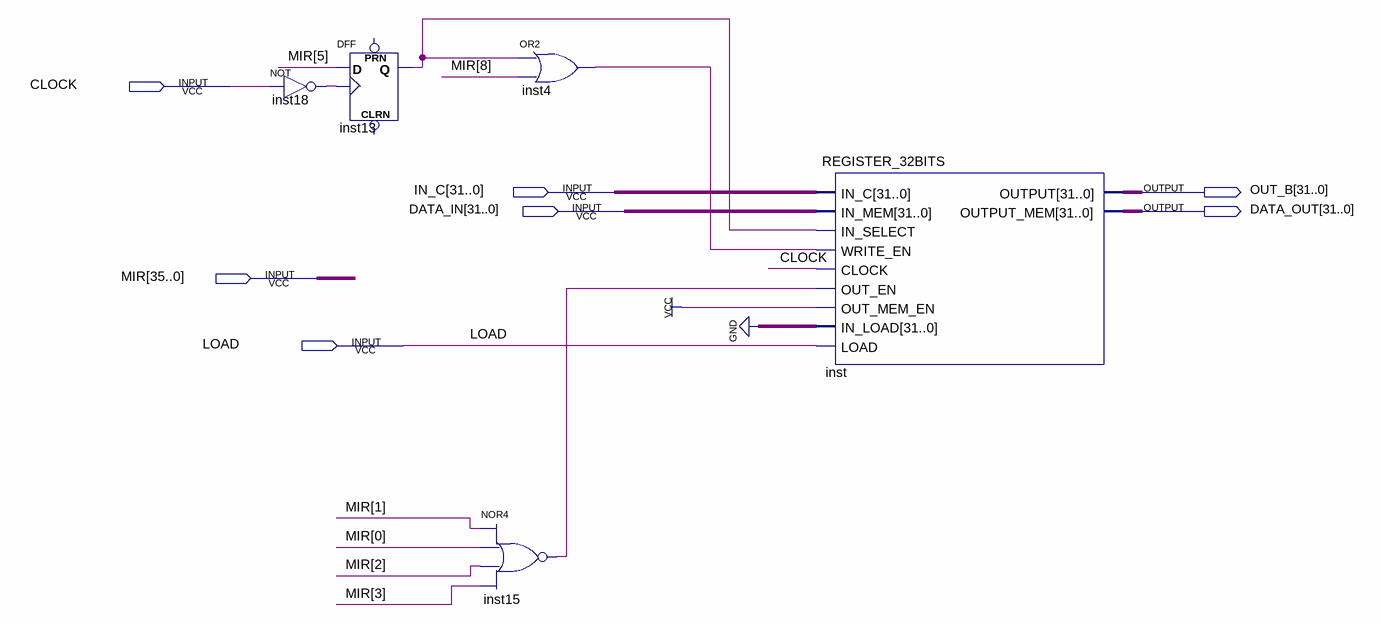
[diagram p0: schematic sheet]
// Quartus schematic MDR.bdf as structural Verilog: 5 symbols, 7 pins
module MDR (
  input  CLOCK,
  input  [31:0] IN_C,
  input  [31:0] DATA_IN,
  input  [35:0] MIR,
  input  LOAD,
  output [31:0] OUT_B,
  output [31:0] DATA_OUT
);

  wire inst4_out, inst13_q, inst15_out, inst18_out;

  not inst18 (inst18_out, CLOCK);
  DFF inst13 (.CLK(inst18_out), .D(MIR[5]), .Q(inst13_q));  // open: CLRN, PRN
  or inst4 (inst4_out, inst13_q, MIR[8]);
  nor inst15 (inst15_out, MIR[1], MIR[0], MIR[2], MIR[3]);
  REGISTER_32BITS inst (
    .IN_C(IN_C), .IN_MEM(DATA_IN), .IN_SELECT(inst13_q), .WRITE_EN(inst4_out), .CLOCK(CLOCK),
    .OUT_EN(inst15_out), .OUT_MEM_EN(1'b1), .IN_LOAD({32{1'b0}}), .LOAD(LOAD), .OUTPUT(OUT_B),
    .OUTPUT_MEM(DATA_OUT));
endmodule
